# Altium schematic sheet ESP32_chip.SchDoc
size A; SheetNumber: 5; SheetTotal: 5
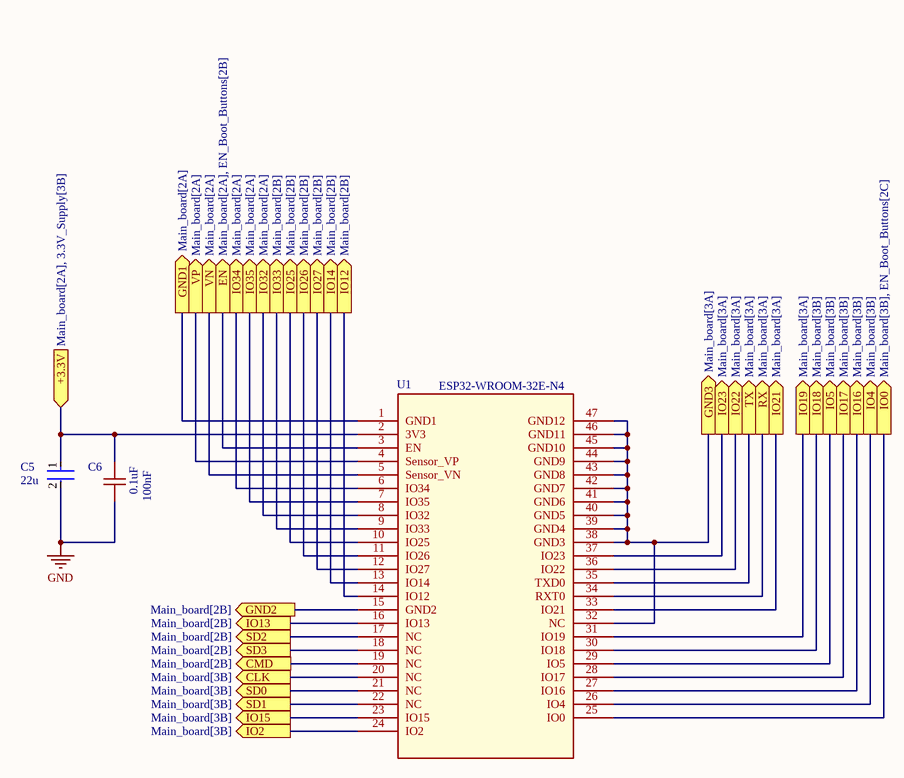
[diagram p0: ESP32_chip.SchDoc]

## Parts
C5  22u  [FP-GRM21B-0_15-IPC_A]
C6  100nF  [CAPC2013X140X45ML15T25]
U1  ESP32-WROOM-32E-N4  [ESP32­WROOM­32E_EXP]

## Ports
+3.3V (in, see Main_board[2A], 3.3V_Supply[3B]), CLK (out, see Main_board[3B]), CMD (out, see Main_board[2B]), EN (out, see Main_board[2A], EN_Boot_Buttons[2B]), GND1 (out, see Main_board[2A]), GND2 (out, see Main_board[2B]), GND3 (out, see Main_board[3A]), IO0 (out, see Main_board[3B], EN_Boot_Buttons[2C]), IO2 (out, see Main_board[3B]), IO4 (out, see Main_board[3B]), IO5 (out, see Main_board[3B]), IO12 (out, see Main_board[2B]), IO13 (out, see Main_board[2B]), IO14 (out, see Main_board[2B]), IO15 (out, see Main_board[3B]), IO16 (out, see Main_board[3B]), IO17 (out, see Main_board[3B]), IO18 (out, see Main_board[3B]), IO19 (out, see Main_board[3A]), IO21 (out, see Main_board[3A]), IO22 (out, see Main_board[3A]), IO23 (out, see Main_board[3A]), IO25 (out, see Main_board[2B]), IO26 (out, see Main_board[2B]), IO27 (out, see Main_board[2B]), IO32 (out, see Main_board[2A]), IO33 (out, see Main_board[2B]), IO34 (out, see Main_board[2A]), IO35 (out, see Main_board[2A]), RX (out, see Main_board[3A]), SD0 (out, see Main_board[3B]), SD1 (out, see Main_board[3B]), SD2 (out, see Main_board[2B]), SD3 (out, see Main_board[2B]), TX (out, see Main_board[3A]), VN (out, see Main_board[2A]), VP (out, see Main_board[2A])

## Nets
GND: C5.2 C6.1
+3.3V: C5.1 C6.2 U1.2(3V3) ; port +3.3V
CLK: U1.20(NC) ; port CLK
CMD: U1.19(NC) ; port CMD
EN: U1.3(EN) ; port EN
GND1: U1.1(GND1) ; port GND1
GND2: U1.15(GND2) ; port GND2
GND3: U1.32(NC) U1.38(GND3) U1.39(GND4) U1.40(GND5) U1.41(GND6) U1.42(GND7) U1.43(GND8) U1.44(GND9) U1.45(GND10) U1.46(GND11) U1.47(GND12) ; port GND3
IO0: U1.25(IO0) ; port IO0
IO2: U1.24(IO2) ; port IO2
IO4: U1.26(IO4) ; port IO4
IO5: U1.29(IO5) ; port IO5
IO12: U1.14(IO12) ; port IO12
IO13: U1.16(IO13) ; port IO13
IO14: U1.13(IO14) ; port IO14
IO15: U1.23(IO15) ; port IO15
IO16: U1.27(IO16) ; port IO16
IO17: U1.28(IO17) ; port IO17
IO18: U1.30(IO18) ; port IO18
IO19: U1.31(IO19) ; port IO19
IO21: U1.33(IO21) ; port IO21
IO22: U1.36(IO22) ; port IO22
IO23: U1.37(IO23) ; port IO23
IO25: U1.10(IO25) ; port IO25
IO26: U1.11(IO26) ; port IO26
IO27: U1.12(IO27) ; port IO27
IO32: U1.8(IO32) ; port IO32
IO33: U1.9(IO33) ; port IO33
IO34: U1.6(IO34) ; port IO34
IO35: U1.7(IO35) ; port IO35
RX: U1.34(RXT0) ; port RX
SD0: U1.21(NC) ; port SD0
SD1: U1.22(NC) ; port SD1
SD2: U1.17(NC) ; port SD2
SD3: U1.18(NC) ; port SD3
TX: U1.35(TXD0) ; port TX
VN: U1.5(Sensor_VN) ; port VN
VP: U1.4(Sensor_VP) ; port VP

## Notes on the sheet
- (in symbol GCM21BR71E104KA37L) 0.1uF

## Library data of the parts
C5 = GRM21BR61A226ME51L: 0805 22 uF 10 V ±20% Tolerance X5R SMT Multilayer Ceramic Capacitor; Manufacturer: Murata; Manufacturer Lifecycle Status: IN PRODUCTION; Value: 22µF; Voltage Rating: 10V; Supplier: DigiKey; Supplier Part Number: 490-10511-1-ND; Manufacturer Part Number: GRM21BR61A226ME51L; RoHS: Compliant; Category: Ceramic Capacitors; Stock: 246273; Pricing: 1=0.19, 10=0.111, 50=0.0788, 100=0.069, 500=0.0526, 1000=0.04756 (USD); Case/Package: 0805; Case Code (Imperial): 0805; Case Code (Metric): 2012; Depth: 1.25mm; Dielectric: X5R; Dielectric Material: Ceramic; Height: 1.25mm; Lead Free: Lead Free; Length: 2mm; Lifecycle Status: Production; Material: Ceramic; Max Operating Temperature: 85°C; Min Operating Temperature: -55°C; Mounting Technology: Surface Mount; Number of Terminals: 2; Packaging: Cut Tape; Radiation Hardening: No; REACH SVHC: Yes; Schedule B: 8532240020, 8532240020|8532240020, 8532240020|8532240020|8532240020, 8532240020|8532240020|8532240020|8532240020; Termination: SMD/SMT; Thickness: 1.25mm; Tolerance: 20%; Voltage Rating (DC): 10V; Weight: 9.49709mg; Width: 1.25mm; ComponentLink1URL: https://datasheet.octopart.com:443/GRM21BR61A226ME51L-Murata-datasheet-46741949.pdf?src-supplier=element14+APAC; ComponentLink1Description: https://datasheet.octopart.com:443/GRM21BR61A226ME51L-Murata-datasheet-46741949.pdf?src-supplier=element14+APAC; ComponentLink2URL: https://datasheet.octopart.com:443/GRM21BR61A226ME51L-Murata-datasheet-141278167.pdf?src-supplier=Geoflip; ComponentLink2Description: https://datasheet.octopart.com:443/GRM21BR61A226ME51L-Murata-datasheet-141278167.pdf?src-supplier=Geoflip; ComponentLink3URL: https://datasheet.octopart.com:443/GRM21BR61A226ME51L-Murata-datasheet-165579666.pdf?src-supplier=TME; ComponentLink3Description: https://datasheet.octopart.com:443/GRM21BR61A226ME51L-Murata-datasheet-165579666.pdf?src-supplier=TME; ComponentLink4URL: https://datasheet.octopart.com:443/GRM21BR61A226ME51L-Murata-datasheet-81455648.pdf?src-supplier=TME; ComponentLink4Description: https://datasheet.octopart.com:443/GRM21BR61A226ME51L-Murata-datasheet-81455648.pdf?src-supplier=TME; ComponentLink5URL: https://datasheet.octopart.com:443/GRM21BR61A226ME51L-Murata-datasheet-140707522.pdf?src-supplier=Ciiva; ComponentLink5Description: https://datasheet.octopart.com:443/GRM21BR61A226ME51L-Murata-datasheet-140707522.pdf?src-supplier=Ciiva; ComponentLink6URL: https://datasheet.octopart.com:443/GRM21BR61A226ME51L-Murata-datasheet-138744834.pdf?src-supplier=Ciiva; ComponentLink6Description: https://datasheet.octopart.com:443/GRM21BR61A226ME51L-Murata-datasheet-138744834.pdf?src-supplier=Ciiva; ComponentLink7URL: https://datasheet.octopart.com:443/GRM21BR61A226ME51L-Murata-datasheet-22122223.pdf?src-supplier=Future+Electronics; ComponentLink7Description: https://datasheet.octopart.com:443/GRM21BR61A226ME51L-Murata-datasheet-22122223.pdf?src-supplier=Future+Electronics; ComponentLink8URL: https://datasheet.octopart.com/GRM21BR61A226ME51L-Murata-datasheet-12515295.pdf; ComponentLink8Description: https://datasheet.octopart.com/GRM21BR61A226ME51L-Murata-datasheet-12515295.pdf; ComponentLink9URL: https://datasheet.octopart.com/GRM21BR61A226ME51L-Murata-datasheet-12510076.pdf; ComponentLink9Description: https://datasheet.octopart.com/GRM21BR61A226ME51L-Murata-datasheet-12510076.pdf; ComponentLink10URL: https://datasheet.octopart.com/GRM21BR61A226ME51L-Murata-datasheet-11978611.pdf; ComponentLink10Description: https://datasheet.octopart.com/GRM21BR61A226ME51L-Murata-datasheet-11978611.pdf; ComponentLink11URL: https://datasheet.octopart.com/GRM21BR61A226ME51L-Murata-datasheet-10025737.pdf; ComponentLink11Description: https://datasheet.octopart.com/GRM21BR61A226ME51L-Murata-datasheet-10025737.pdf; ComponentLink12URL: https://datasheet.octopart.com/GRM21BR61A226ME51L-Murata-datasheet-8819587.pdf; ComponentLink12Description: https://datasheet.octopart.com/GRM21BR61A226ME51L-Murata-datasheet-8819587.pdf; ComponentLink13URL: https://datasheet.octopart.com/GRM21BR61A226ME51L-Murata-datasheet-14402366.pdf; ComponentLink13Description: https://datasheet.octopart.com/GRM21BR61A226ME51L-Murata-datasheet-14402366.pdf; ComponentLink14URL: http://sigma.octopart.com:80/reach_statement/Murata-company-16.pdf?src-supplier=Compliance+Statements; ComponentLink14Description: http://sigma.octopart.com:80/reach_statement/Murata-company-16.pdf?src-supplier=Compliance+Statements
C6 = GCM21BR71E104KA37L: Ceramic Capacitor, Ceramic, 25V, 10% +Tol, 10% -Tol, X7R, 15% TC, 0.1uF, Surface Mount, 0805; Manufacturer: Murata; Manufacturer Lifecycle Status: NRND; Supplier: DigiKey; Supplier Part Number: 490-14779-1-ND; Manufacturer Part Number: GCM21BR71E104KA37L; RoHS: Compliant; Category: Ceramic Capacitors; Stock: 12316; Pricing: 1=0.35, 10=0.208, 50=0.1528, 100=0.1358, 500=0.10726, 1000=0.09846 (USD); Value: 100nF; Case/Package: 0805; Case Code (Imperial): 0805; Case Code (Metric): 2012; Depth: 1.25mm; Dielectric: X7R; Dielectric Material: Ceramic; Height: 1.25mm; Length: 2mm; Lifecycle Status: NRND; Max Operating Temperature: 125°C; Min Operating Temperature: -55°C; Mounting Technology: Surface Mount; Number of Terminals: 2; Radiation Hardening: No; Ratings: AEC-Q200; REACH SVHC: Yes; Schedule B: 8532240020, 8532240020|8532240020|8532240020|8532240020|8532240020; Termination: SMD/SMT; Tolerance: 10%; Voltage Rating: 25V; Voltage Rating (DC): 25V; Width: 1.25mm; ComponentLink1URL: https://datasheet.octopart.com:443/GCM21BR71E104KA37L-Murata-datasheet-141268656.pdf?src-supplier=Geoflip; ComponentLink1Description: https://datasheet.octopart.com:443/GCM21BR71E104KA37L-Murata-datasheet-141268656.pdf?src-supplier=Geoflip; ComponentLink2URL: https://datasheet.octopart.com:443/GCM21BR71E104KA37L-Murata-datasheet-140660253.pdf?src-supplier=Ciiva; ComponentLink2Description: https://datasheet.octopart.com:443/GCM21BR71E104KA37L-Murata-datasheet-140660253.pdf?src-supplier=Ciiva; ComponentLink3URL: https://datasheet.octopart.com:443/GCM21BR71E104KA37L-Murata-datasheet-138719617.pdf?src-supplier=Ciiva; ComponentLink3Description: https://datasheet.octopart.com:443/GCM21BR71E104KA37L-Murata-datasheet-138719617.pdf?src-supplier=Ciiva; ComponentLink4URL: https://datasheet.octopart.com:443/GCM21BR71E104KA37L-Murata-datasheet-128592896.pdf?src-supplier=X-ON; ComponentLink4Description: https://datasheet.octopart.com:443/GCM21BR71E104KA37L-Murata-datasheet-128592896.pdf?src-supplier=X-ON; ComponentLink5URL: https://datasheet.octopart.com/GCM21BR71E104KA37L-Murata-datasheet-14404970.pdf; ComponentLink5Description: https://datasheet.octopart.com/GCM21BR71E104KA37L-Murata-datasheet-14404970.pdf; ComponentLink6URL: http://sigma.octopart.com:80/reach_statement/Murata-company-16.pdf?src-supplier=Compliance+Statements; ComponentLink6Description: http://sigma.octopart.com:80/reach_statement/Murata-company-16.pdf?src-supplier=Compliance+Statements
U1 = ESP32-WROOM-32E-N4: WLAN+BT Module 2412MHz to 2484MHz 47-Pin SMD Module; Manufacturer: Espressif Systems; Max Supply Voltage: 3.6V; Min Supply Voltage: 3V; Operating Supply Voltage: 3.3V; Supplier: DigiKey; Supplier Part Number: 1965-ESP32-WROOM-32E-N4CT-ND; Manufacturer Part Number: ESP32-WROOM-32E-N4; RoHS: Compliant; Category: RF Transceiver Modules and Modems; Stock: 39100; Pricing: 1=4.84, 10=4.189, 25=3.9612, 100=3.649, 250=3.46184 (USD); Height - Seated (Max): 3.25mm; Length: 25.5mm; Max Operating Temperature: 85°C; Min Operating Temperature: -40°C; Number of Terminals: 38; REACH SVHC: Yes; Terminal Pitch: 1.27mm; Width: 18mm; ComponentLink1URL: https://datasheet.octopart.com:443/ESP32-WROOM-32E-N4-Espressif-Systems-datasheet-182247776.pdf?src-supplier=IHS; ComponentLink1Description: https://datasheet.octopart.com:443/ESP32-WROOM-32E-N4-Espressif-Systems-datasheet-182247776.pdf?src-supplier=IHS; ComponentLink2URL: https://datasheet.octopart.com:443/ESP32-WROOM-32E-N4-Espressif-Systems-datasheet-188867343.pdf?src-supplier=TME; ComponentLink2Description: https://datasheet.octopart.com:443/ESP32-WROOM-32E-N4-Espressif-Systems-datasheet-188867343.pdf?src-supplier=TME; ComponentLink3URL: https://datasheet.octopart.com:443/ESP32-WROOM-32E-N4-Espressif-Systems-datasheet-165560559.pdf?src-supplier=TME; ComponentLink3Description: https://datasheet.octopart.com:443/ESP32-WROOM-32E-N4-Espressif-Systems-datasheet-165560559.pdf?src-supplier=TME; ComponentLink4URL: https://datasheet.octopart.com:443/ESP32-WROOM-32E-N4-Espressif-Systems-datasheet-151884363.pdf?src-supplier=Future+Electronics; ComponentLink4Description: https://datasheet.octopart.com:443/ESP32-WROOM-32E-N4-Espressif-Systems-datasheet-151884363.pdf?src-supplier=Future+Electronics